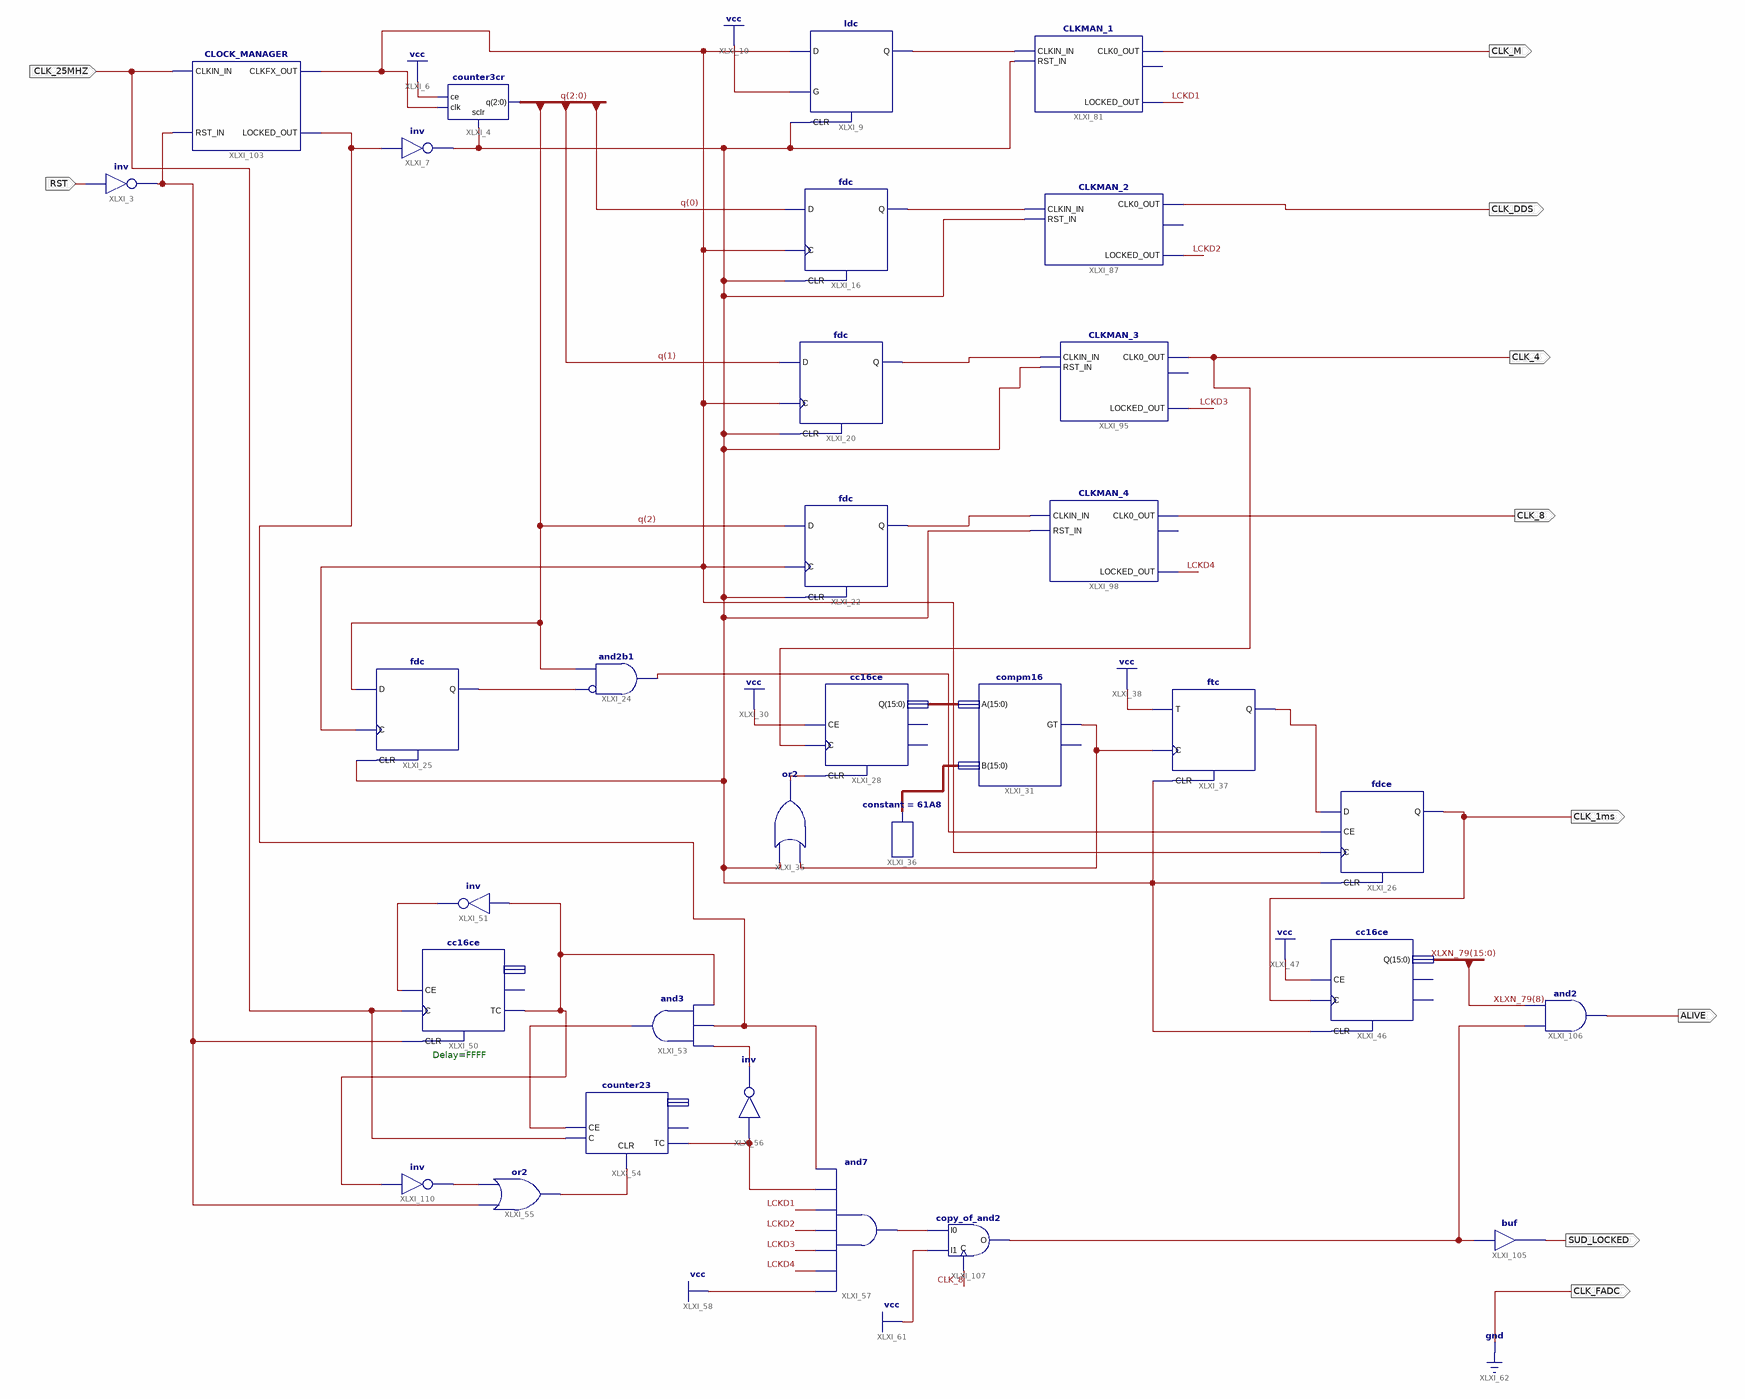
[diagram p0: schematic sheet 1]
// Xilinx ISE schematic CLK_GEN.sch (spartan3a) as structural Verilog: 32 symbols, 10 ports
module CLK_GEN (
  input  CLK_25MHZ,
  input  RST,
  output CLK_DDS,
  output CLK_8,
  output CLK_1ms,
  output CLK_FADC,
  output CLK_4,
  output CLK_M,
  output SUD_LOCKED,
  output ALIVE
);

  wire Clock_Manager_FXOUT, LCKD1, LCKD2, LCKD3, LCKD4, Reset, S_CLK_4, S_CLK_8, S_CLK_DDS, S_CLK_M, XLXN_2,
       XLXN_7, XLXN_39, XLXN_44, XLXN_62, XLXN_63, XLXN_70, XLXN_86, XLXN_92, XLXN_95, XLXN_96, XLXN_106,
       XLXN_107, XLXN_112, XLXN_172, XLXN_181;
  wire [2:0] q;
  wire [15:0] XLXN_57, XLXN_58, XLXN_79;

  not XLXI_3 (XLXN_2, RST);
  counter3cr XLXI_4 (.clk(Clock_Manager_FXOUT), .ce(1'b1), .sclr(Reset), .q(q));
  not XLXI_7 (Reset, XLXN_7);
  ldc XLXI_9 (.CLR(Reset), .D(Clock_Manager_FXOUT), .G(1'b1), .Q(S_CLK_M));
  fdc XLXI_16 (.C(Clock_Manager_FXOUT), .CLR(Reset), .D(q[0]), .Q(S_CLK_DDS));
  fdc XLXI_20 (.C(Clock_Manager_FXOUT), .CLR(Reset), .D(q[1]), .Q(S_CLK_4));
  fdc XLXI_22 (.C(Clock_Manager_FXOUT), .CLR(Reset), .D(q[2]), .Q(S_CLK_8));
  and XLXI_24 (XLXN_44, ~XLXN_39, q[2]);  // and2b1
  fdc XLXI_25 (.C(Clock_Manager_FXOUT), .CLR(Reset), .D(q[2]), .Q(XLXN_39));
  cc16ce XLXI_28 (.C(CLK_4), .CE(1'b1), .CLR(XLXN_62), .Q(XLXN_57));  // open: CEO, TC
  compm16 XLXI_31 (.A(XLXN_57), .B(XLXN_58), .GT(XLXN_63));  // open: LT
  or XLXI_35 (XLXN_62, XLXN_63, Reset);
  constant #(.CValue("61A8")) XLXI_36 (.O(XLXN_58));
  ftc XLXI_37 (.C(XLXN_63), .CLR(Reset), .T(1'b1), .Q(XLXN_70));
  cc16ce XLXI_46 (.C(CLK_1ms), .CE(1'b1), .CLR(Reset), .Q(XLXN_79));  // open: CEO, TC
  cc16ce XLXI_50 (.C(CLK_25MHZ), .CE(XLXN_86), .CLR(XLXN_2), .TC(XLXN_112));  // open: CEO, Q
  not XLXI_51 (XLXN_86, XLXN_112);
  and XLXI_53 (XLXN_107, XLXN_112, XLXN_7, XLXN_96);
  counter23 XLXI_54 (.TC(XLXN_95), .CLR(XLXN_92), .C(CLK_25MHZ), .CE(XLXN_107));  // open: Q, CEO
  or XLXI_55 (XLXN_92, XLXN_2, XLXN_181);
  not XLXI_56 (XLXN_96, XLXN_95);
  and XLXI_57 (XLXN_106, 1'b1, LCKD4, LCKD3, LCKD2, LCKD1, XLXN_95, XLXN_7);
  CLKMAN_1 XLXI_81 (.RST_IN(Reset), .CLKIN_IN(S_CLK_M), .LOCKED_OUT(LCKD1), .CLK0_OUT(CLK_M));  // open: CLK90_OUT
  CLKMAN_2 XLXI_87 (.RST_IN(Reset), .CLKIN_IN(S_CLK_DDS), .CLK0_OUT(CLK_DDS), .LOCKED_OUT(LCKD2));  // open: CLK90_OUT
  CLKMAN_3 XLXI_95 (.RST_IN(Reset), .CLKIN_IN(S_CLK_4), .LOCKED_OUT(LCKD3), .CLK0_OUT(CLK_4));  // open: CLK90_OUT
  CLKMAN_4 XLXI_98 (.RST_IN(Reset), .CLKIN_IN(S_CLK_8), .LOCKED_OUT(LCKD4), .CLK0_OUT(CLK_8));  // open: CLK90_OUT
  CLOCK_MANAGER XLXI_103 (.CLKIN_IN(CLK_25MHZ), .RST_IN(XLXN_2), .CLKFX_OUT(Clock_Manager_FXOUT), .LOCKED_OUT(XLXN_7));
  buf XLXI_105 (SUD_LOCKED, XLXN_172);
  and XLXI_106 (ALIVE, XLXN_172, XLXN_79[8]);
  copy_of_and2 XLXI_107 (.I0(XLXN_106), .I1(1'b1), .O(XLXN_172), .C(CLK_8));
  not XLXI_110 (XLXN_181, XLXN_112);
  fdce XLXI_26 (.C(Clock_Manager_FXOUT), .CE(XLXN_44), .CLR(Reset), .D(XLXN_70), .Q(CLK_1ms));

  assign CLK_FADC = 1'b0;

  // Notes on the sheet:
  //   Delay=FFFF
endmodule
